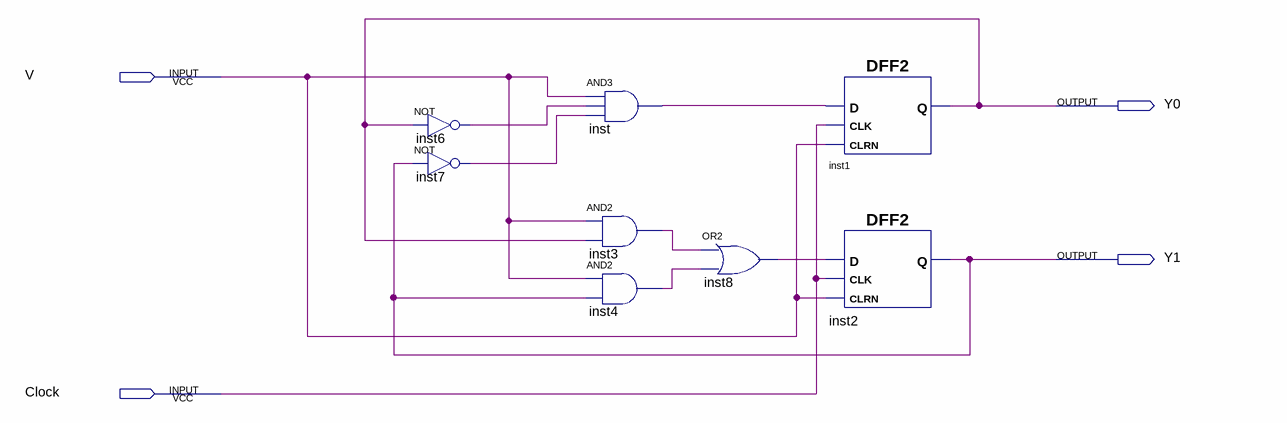
[diagram p0: schematic sheet]
// Quartus schematic inputbufferblock.bdf as structural Verilog: 8 symbols, 4 pins
module inputbufferblock (
  input  V,
  input  Clock,
  output Y0,
  output Y1
);

  wire inst3_out, inst4_out, inst6_out, inst7_out, inst8_out, inst_out;

  not inst6 (inst6_out, Y0);
  not inst7 (inst7_out, Y1);
  and inst (inst_out, V, inst6_out, inst7_out);
  and inst3 (inst3_out, V, Y0);
  and inst4 (inst4_out, V, Y1);
  or inst8 (inst8_out, inst3_out, inst4_out);
  DFF2 inst1 (.CLK(Clock), .CLRN(V), .D(inst_out), .Q(Y0));
  DFF2 inst2 (.CLK(Clock), .CLRN(V), .D(inst8_out), .Q(Y1));
endmodule
